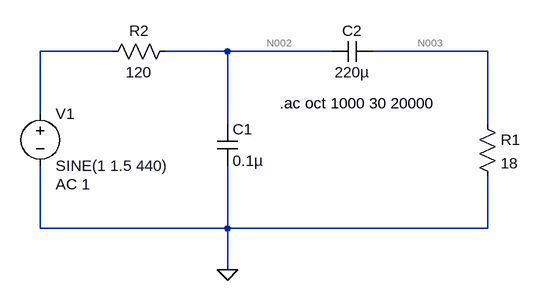
[diagram p0: schematic LPF_HPF_for_DAC_and_earphone.asc]
LPF_HPF_for_DAC_and_earphone.asc, the LTspice schematic file:
Version 4
SHEET 1 880 680
WIRE 128 0 16 0
WIRE 304 0 208 0
WIRE 464 0 304 0
WIRE 704 0 528 0
WIRE 16 96 16 0
WIRE 304 112 304 0
WIRE 704 112 704 0
WIRE 16 272 16 176
WIRE 304 272 304 176
WIRE 304 272 16 272
WIRE 704 272 704 192
WIRE 704 272 304 272
WIRE 304 336 304 272
FLAG 304 336 0
SYMBOL voltage 16 80 R0
WINDOW 123 24 124 Left 2
WINDOW 39 0 0 Left 0
SYMATTR Value2 AC 1
SYMATTR InstName V1
SYMATTR Value SINE(1 1.5 440)
SYMBOL cap 288 112 R0
SYMATTR InstName C1
SYMATTR Value 0.1µ
SYMBOL res 224 -16 R90
WINDOW 0 0 56 VBottom 2
WINDOW 3 32 56 VTop 2
SYMATTR InstName R2
SYMATTR Value 120
SYMBOL cap 528 -16 R90
WINDOW 0 0 32 VBottom 2
WINDOW 3 32 32 VTop 2
SYMATTR InstName C2
SYMATTR Value 220µ
SYMBOL res 688 96 R0
SYMATTR InstName R1
SYMATTR Value 18
TEXT 384 80 Left 2 !.ac oct 1000 30 20000

The netlist it stands for:
* LPF_HPF_for_DAC_and_earphone.asc
V1 N001 0 SINE(1 1.5 440) AC 1
C1 N002 0 0.1µ
R2 N002 N001 120
C2 N003 N002 220µ
R1 N003 0 18
.ac oct 1000 30 20000
.backanno
.end

* Results of the author's LTspice run, read from the files saved beside the schematic
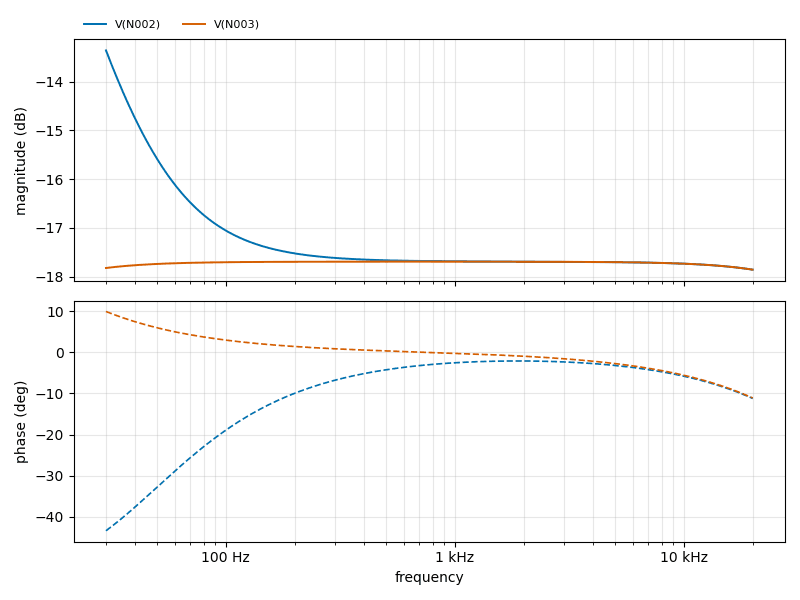
[diagram p1: AC Analysis of LPF_HPF_for_DAC_and_earphone.asc, plotted from the saved traces]
* AC Analysis, 1 run:
*   V(N002): -13.36 dB at 30 Hz, -17.86 dB at 20 kHz, peak -13.36 dB at 30 Hz, 3 dB below the peak at 66.58 Hz
*   V(N003): -17.83 dB at 30 Hz, -17.86 dB at 20 kHz, peak -17.70 dB at 730.1 Hz